# Altium schematic sheet RELAYS.SchDoc
size B
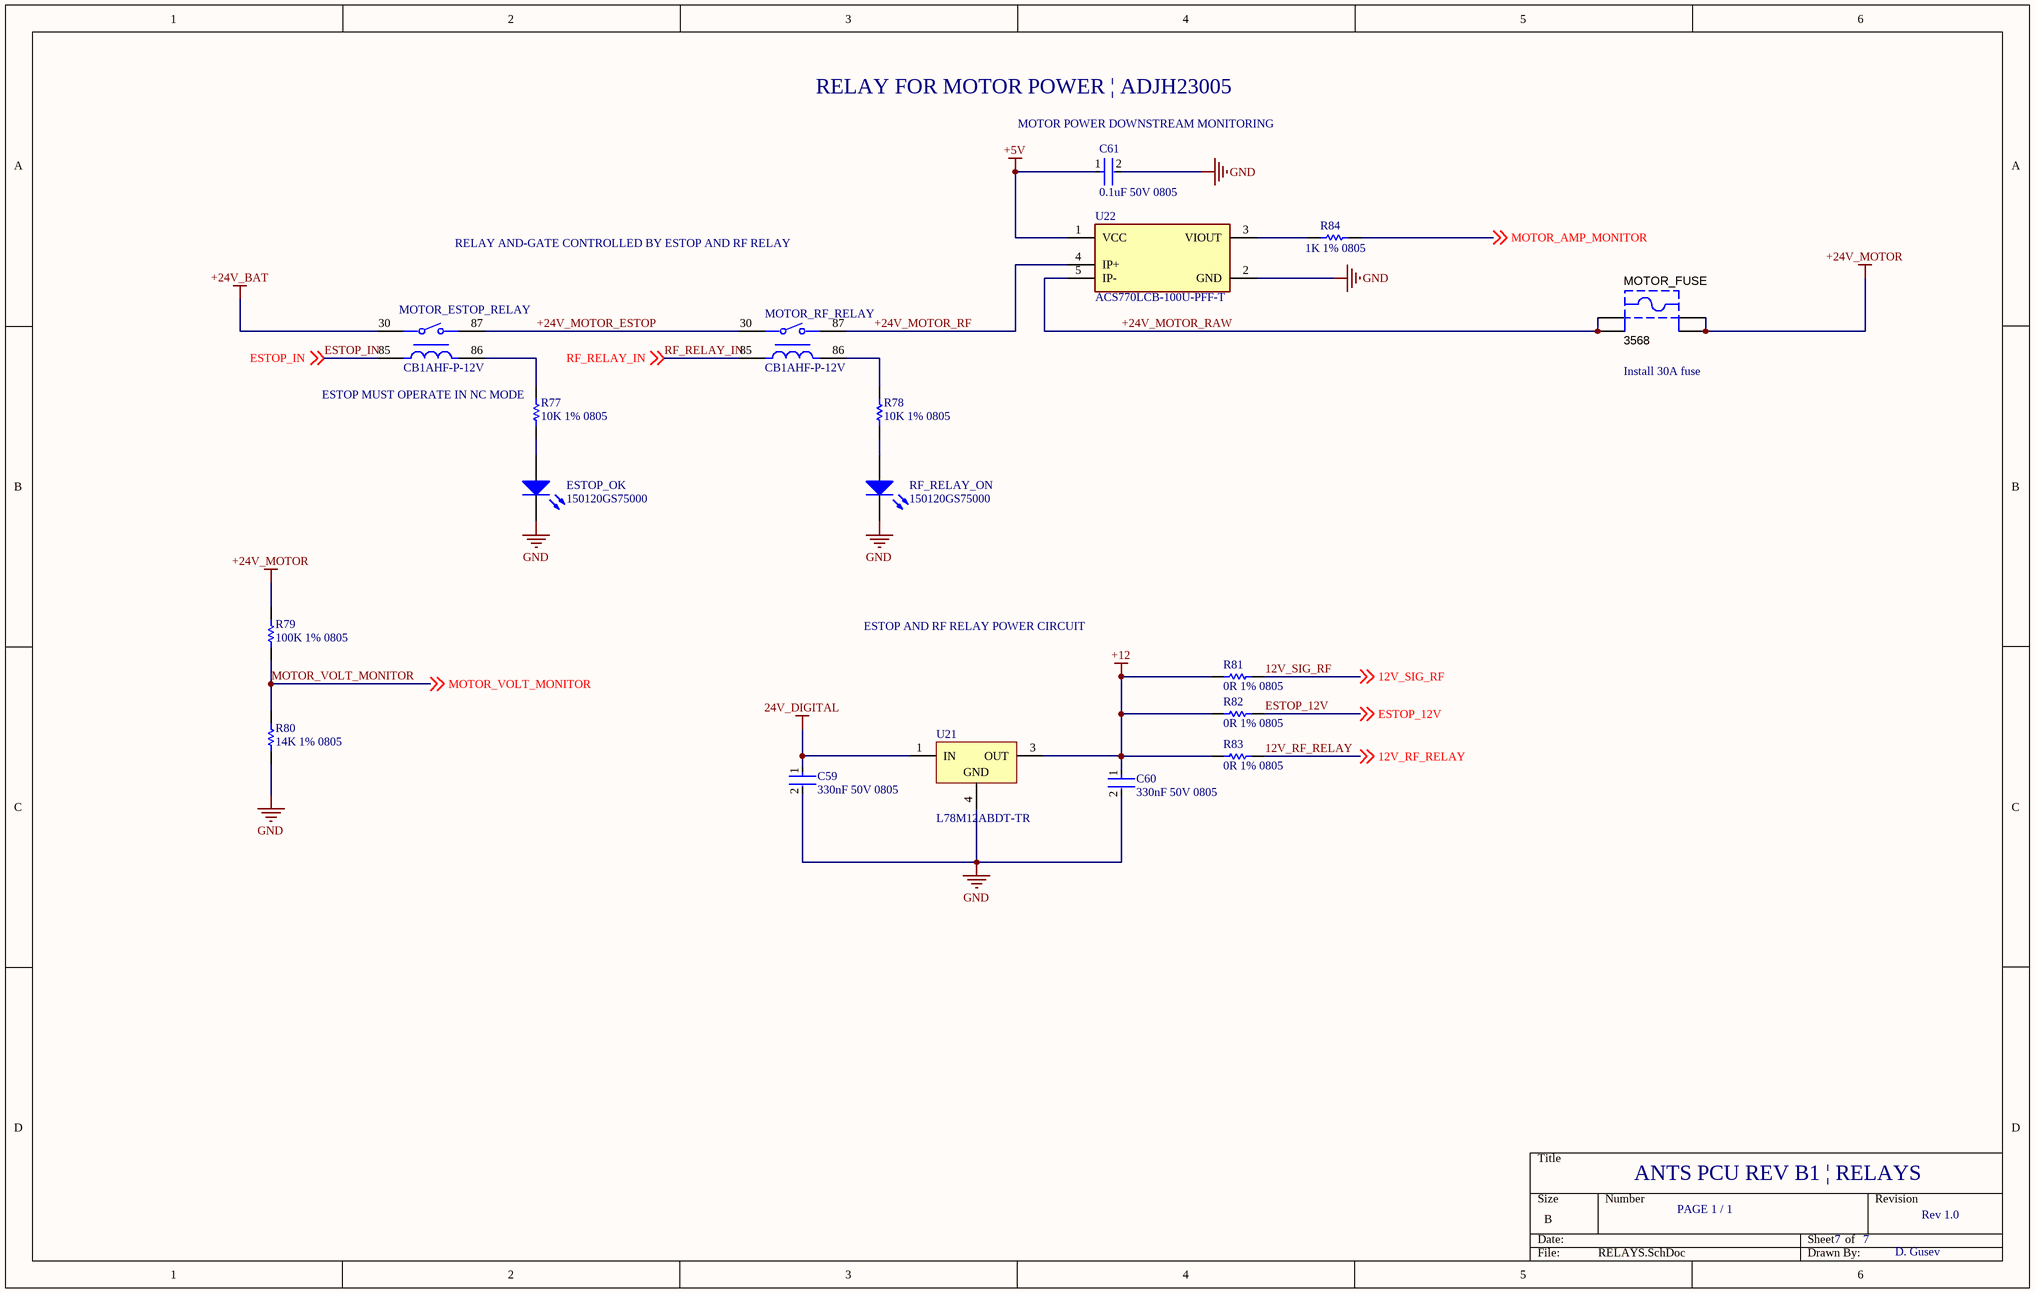
[diagram p0: RELAYS.SchDoc]

## Parts
C59  330nF 50V 0805  [FP-C0805C-DN-MFG]
C60  330nF 50V 0805  [FP-C0805C-DN-MFG]
C61  0.1uF 50V 0805  [FP-C0805C-DN-MFG]
ESTOP_OK  150120GS75000  [1206_A]
MOTOR_ESTOP_RELAY  CB1AHF-P-12V  [FP-CB1AHF-P-12V-MFG]
MOTOR_FUSE  3568  [KSTN-3568_V]
MOTOR_RF_RELAY  CB1AHF-P-12V  [FP-CB1AHF-P-12V-MFG]
R77  10K 1% 0805  [RESC2013X60X35NL10T20]
R78  10K 1% 0805  [RESC2013X60X35NL10T20]
R79  100K 1% 0805  [RESC2013X60X35ML10T20]
R80  14K 1% 0805  [RESC2013X60X35LL10T20]
R81  0R 1% 0805  [RESC2013X60X35LL10T20]
R82  0R 1% 0805  [RESC2013X60X35LL10T20]
R83  0R 1% 0805  [RESC2013X60X35LL10T20]
R84  1K 1% 0805  [RESC2013X60X35ML10T20]
RF_RELAY_ON  150120GS75000  [1206_A]
U21  L78M12ABDT-TR  [TO-252_M]
U22  ACS770LCB-100U-PFF-T  [ACS770LCB-100U-PFF-T]

## Nets
24V_DIGITAL: C59.1 U21.1(IN)
+5V: C61.1 U22.1(VCC)
+12: C60.1 R81.1 R82.1 R83.1 U21.3(OUT)
+24V_BAT: MOTOR_ESTOP_RELAY.30
+24V_MOTOR: MOTOR_FUSE.3 MOTOR_FUSE.4 R79.2
GND: C59.2 C60.2 C61.2 ESTOP_OK.1(K) R80.1 RF_RELAY_ON.1(K) U21.4(GND) U22.2(GND)
12V_RF_RELAY: R83.2 ; off-sheet 12V_RF_RELAY
12V_SIG_RF: R81.2 ; off-sheet 12V_SIG_RF
+24V_MOTOR_ESTOP: MOTOR_ESTOP_RELAY.87 MOTOR_RF_RELAY.30
+24V_MOTOR_RAW: MOTOR_FUSE.1 MOTOR_FUSE.2 U22.5(IP-)
+24V_MOTOR_RF: MOTOR_RF_RELAY.87 U22.4(IP+)
ESTOP_12V: R82.2 ; off-sheet ESTOP_12V
ESTOP_IN: MOTOR_ESTOP_RELAY.85 ; off-sheet ESTOP_IN
MOTOR_AMP_MONITOR: R84.2 ; off-sheet MOTOR_AMP_MONITOR
MOTOR_VOLT_MONITOR: R79.1 R80.2 ; off-sheet MOTOR_VOLT_MONITOR
RF_RELAY_IN: MOTOR_RF_RELAY.85 ; off-sheet RF_RELAY_IN
NetESTOP_OK_2: ESTOP_OK.2(A) R77.1
NetMOTOR_ESTOP_RELAY_86: MOTOR_ESTOP_RELAY.86 R77.2
NetMOTOR_RF_RELAY_86: MOTOR_RF_RELAY.86 R78.2
NetR78_1: R78.1 RF_RELAY_ON.2(A)
NetR84_1: R84.1 U22.3(VIOUT)

## Notes on the sheet
- RELAY FOR MOTOR POWER | ADJH23005
- (near C61) MOTOR POWER DOWNSTREAM MONITORING
- RELAY AND-GATE CONTROLLED BY ESTOP AND RF RELAY
- ESTOP MUST OPERATE IN NC MODE
- (near MOTOR_FUSE) Install 30A fuse
- ESTOP AND RF RELAY POWER CIRCUIT
- ANTS PCU REV B1 | RELAYS
- PAGE 1 / 1
- 7
- Rev 1.0
- D. Gusev

## Library data of the parts
C59 C60 = CMP-1036-04607-3: CAP CER 0.33UF 50V X7R 0805; Manufacturer Part Number: C0805C334K5RACTU; Manufacturer: KEMET; Temperature Coefficient: 30ppm/°C; Value: 0.33 μF; Material: Ceramic; Tolerance: 0.1; Temperature: -55°C to +125°C; Temperature Range Low: -55°C; Voltage Rating: 50 V; Lead Free: Yes; Mouser Description: Multilayer Ceramic Capacitors MLCC - SMD/SMT 50volts 0.33uF 10% X7R; Automotive: No; Package: C0805C-DN; Temperature Characteristic: X7R; Capacitance: 0.33 μF; Digikey Description: CAP CER 0.33UF 50V X7R 0805; Device Class L3: Ceramic Capacitors; Temperature Range High: +125°C; Category: Cap; Ipc Land Pattern Name: CAPC200125X78; ComponentLink2URL: https://content.kemet.com/datasheets/KEM_C1003_C0G_SMD.pdf; ComponentLink2Description: Datasheet; RoHS: TRUE; Device Class L1: Passive Components; Height: 0.88mm; Octopart: https://octopart.com/c0805c334k5ractu-kemet-10475704; Device Class L2: Capacitors
C61 = CMP-2007-00279-2: CAP CER 0.1UF 50V X7R 0805; Manufacturer Part Number: C0805C104K5RACTU; Manufacturer: KEMET; Value: 0.10 μF; Tolerance: 0.1; Temperature Coefficient: 30ppm/°C; Material: Ceramic; Device Class L2: Capacitors; Temperature Range Low: -55°C; Voltage Rating: 50 V; Digikey Description: CAP CER 0.1UF 50V X7R 0805; Category: Cap; ComponentLink2Description: Datasheet; Octopart: https://octopart.com/c0805c104k5ractu-kemet-143926; RoHS: TRUE; ComponentLink2URL: https://content.kemet.com/datasheets/KEM_C1003_C0G_SMD.pdf; Temperature Characteristic: X7R; Temperature: -55°C to +125°C; Height: 0.88mm; Temperature Range High: +125°C; Device Class L1: Passive Components; Automotive: No; Lead Free: Yes; Ipc Land Pattern Name: CAPC200125X78; Device Class L3: Ceramic Capacitors; Mouser Description: Cap Ceramic 0.1uF 50V X7R 10% SMD 2.0 x 1.2 mm 125 C Paper T/R; Capacitance: 0.10 μF; Package: C0805C-DN
ESTOP_OK RF_RELAY_ON = CMP-1426-00014-1: SMD mono-color Chip LED, WL-SMCW, Green; Manufacturer: Wuerth Elektronik; PackageReference: 1206_A; PartNumber: 150120GS75000; ComponentLink1Description: Manufacturer URL; ComponentLink2URL: http://katalog.we-online.com/led/datasheet/150120GS75000.pdf; ComponentLink2Description: Datasheet; Color: Green; ComponentLink1URL: http://www.we-online.com
MOTOR_ESTOP_RELAY MOTOR_RF_RELAY = CMP-05606-000039-1: RELAY AUTOMOTIVE SPST 70A 12V; Power Consumption: 1.4W; Release Time: 15ms; Contact Current Rating: 40A; Max Voltage Rating (DC): 14V; Coil Resistance: 103R; Coil Current: 117mA; Coil Type: Non-Latching; Coil Voltage (DC): 12V; Lead Free: Lead Free; Series: CB; Termination: PC Pin; Coil Power: 1.4W; Max Operating Temperature: 85°C; Relay Type: Automotive; Width: 26.5mm; Mount: Through Hole; Min Operating Temperature: -40°C; Height: 25.5mm; Contact Material: Silver; RoHS Compliant: Yes; Depth: 22mm; Number of Pins: 4; Throw Configuration: SPST; Packaging: Bulk; REACH SVHC: No SVHC; Package Quantity: 50; Operate Time: 15ms; Max Current Rating: 40A; Length: 26mm
MOTOR_FUSE = CMP-2000-05464-1: Fuse Holder, 20 A, 500 V, -50 to 145 degC, 4-Pin THD, RoHS; Manufacturer: Keystone; Package Reference: 3568; Datasheet Version: 04/2013; Datasheet URL: https://datasheet.ciiva.com/16294/m60-2p40-16294706.pdf; Manufacturer URL: http://www.keyelco.com/; Mounting Technology: ThroughHole; Package Description: 4-Pin Through Hole Device, Body 16 x 6.73 mm, Pitch 9.9 mm
R77 R78 = CMP-1659-00013-4: Chip Resistor, 10 KOhm, +/- 1%, 0.125 W, -55 to 155 degC, 0805 (2012 Metric), RoHS, Tape and Reel; Manufacturer: Yageo; Voltage Rating: 150 V; Mount: Surface Mount; ComponentLink1Description: Manufacturer URL; ComponentLink2URL: http://www.yageo.com/documents/recent/PYu-RC_Group_51_RoHS_L_04.pdf; Pins: 2; Length: 2 mm; Min Operating Temperature: -55 degC; Height: 0.5 mm; Mounting Technology: Surface Mount; RoHSCompliant: true; REACH SVHC: No SVHC; ComponentLink1URL: http://www.yageo.com/; Max Operating Temperature: 155 degC; PackageReference: 0805; DatasheetVersion: Rev. 4, 02/2016; Package Quantity: 5000; Packaging: Tape and Reel; ComponentLink2Description: Datasheet; PackageDescription: 2-Pin Surface Mounted Device, Body 2 x 1.25 mm
R79 = CMP-2100-03668-1: Chip Resistor, 100 KOhm, +/- 1%, 0.125 W, -55 to 155 degC, 0805 (2012 Metric), RoHS, Tape and Reel; Manufacturer: Yageo; Max Power Dissipation: 125mW; Voltage Rating: 150V; Temperature Coefficient: 100ppm/degreesC; Manufacturer URL: http://www.yageo.com/; Min Operating Temperature: -55degC; Lead Pitch: 0.4mm; Composition: ThickFilm; Case Code (Metric): 2012; Military Standard: Not; Package Description: 2-Pin Surface Mounted Device, Body 2 x 1.25 mm; REACH SVHC: Unknown; RoHSCompliant: true; Depth: 1.25mm; Number of Pins: 2; Lead Free: LeadFree; Resistance: 100KOhm; Datasheet URL: http://www.yageo.com/NewPortal/yageodocoutput?fileName=/pdf/R-Chip/PYu-RC_Group_51_RoHS_L_5.pdf; Max Operating Temperature: 155degC; Case/Package: 0805; Package Quantity: 1; Case Code (Imperial): 0805; Power Rating: 125mW; Width: 0.049inch; Package Reference: 0805; Height: 0.024inch; Termination: SMD/SMT; Tolerance: 1%; Datasheet Version: Rev. 5, 10/2016; Length: 2mm; Voltage Rating (DC): 150V; Number of Terminations: 2; Packaging: TapeandReel
R80 = CMP-1013-00638-2: Part Number: RC0805FR-0714KL; Manufacturer: Yageo
R81-R83 = CMP-1659-00014-4: Chip Resistor, 1 Ohm, +/- 1%, 125 mW, -55 to 155 degC, 0805 (2012 Metric), RoHS, Tape and Reel; Manufacturer: Yageo; Voltage Rating: 150 V; REACH SVHC: No SVHC; Mounting Technology: Surface Mount; RoHSCompliant: true; Packaging: Tape and Reel; ComponentLink2URL: http://www.yageo.com/documents/recent/PYu-RC_Group_51_RoHS_L_04.pdf; Pins: 2; Package Quantity: 5000; DatasheetVersion: Rev. 4, 02/2016; Mount: Surface Mount; Max Operating Temperature: 155 degC; PackageDescription: 2-Pin Surface Mounted Device, Body 2 x 1.25 mm; PackageReference: 0805; Length: 2 mm; Min Operating Temperature: -55 degC; ComponentLink1URL: http://www.yageo.com/; Height: 0.5 mm; ComponentLink1Description: Manufacturer URL; ComponentLink2Description: Datasheet
R84 = CMP-2100-03671-1: Chip Resistor, 1 KOhm, +/- 1%, 125 mW, -55 to 155 degC, 0805 (2012 Metric), RoHS, Tape and Reel; Manufacturer: Yageo; Temperature Coefficient: 100ppm/degreesC; Voltage Rating (DC): 150V; Max Power Dissipation: 125mW; Resistance: 1KOhm; Number of Pins: 2; Number of Terminations: 2; Datasheet URL: http://www.yageo.com/NewPortal/yageodocoutput?fileName=/pdf/R-Chip/PYu-RC_Group_51_RoHS_L_5.pdf; Length: 0.079inch; Package Description: 2-Pin Surface Mounted Device, Body 2 x 1.25 mm; Depth: 1.25mm; Height: 0.024inch; Military Standard: Not; Case/Package: 0805; Package Reference: 0805; RoHSCompliant: true; Lead Free: LeadFree; Packaging: TapeandReel; Package Quantity: 1; Datasheet Version: Rev. 5, 10/2016; Tolerance: 1%; Min Operating Temperature: -55degC; Voltage Rating: 150V; Composition: ThickFilm; Case Code (Imperial): 0805; Power Rating: 125mW; Width: 0.049inch; Case Code (Metric): 2012; Manufacturer URL: http://www.yageo.com/; Max Operating Temperature: 155degC; REACH SVHC: Unknown; Termination: SMD/SMT
U21 = CMP-0244-00186-1: Precision 500mA Regulator, 12V, 3-Pin DPAK, Tape and Reel; ComponentLink2Description: Datasheet; PackageDescription: 3-Pin Transistor Outline Package 2.28 mm Pitch, 9.7 mm Lead Span (DPAK); PackageVersion: 2011; ComponentLink2URL: http://www.st.com/internet/com/TECHNICAL_RESOURCES/TECHNICAL_LITERATURE/DATASHEET/CD00000448.pdf; ComponentLink1URL: http://www.st.com; PackageReference: TO-252; DatasheetVersion: 1/11/2010; ComponentLink1Description: Manufacturer URL
U22 = ACS770LCB-100U-PFF-T: SENSOR CURRENT HALL 100A DC; Min Input Voltage: 4.5V; Polarity: Unidirectional; Quiescent Current: 10mA; Bandwidth: 120kHz; Max Input Voltage: 5.5V; Sensitivity: 40mV/A; Accuracy: 0.6%; Response Time: 4.6us; Max Supply Current: 15mA; Linearity: 1%; Number of Channels: 1; Max Operating Temperature: 150°C; Package Quantity: 34; Min Operating Temperature: -40°C; Packaging: Rail/Tube; Number of Pins: 5; Width: 13mm; Height: 7mm; Current Sensing: 100A; Length: 14mm; Frequency: 120kHz; Mount: Through Hole